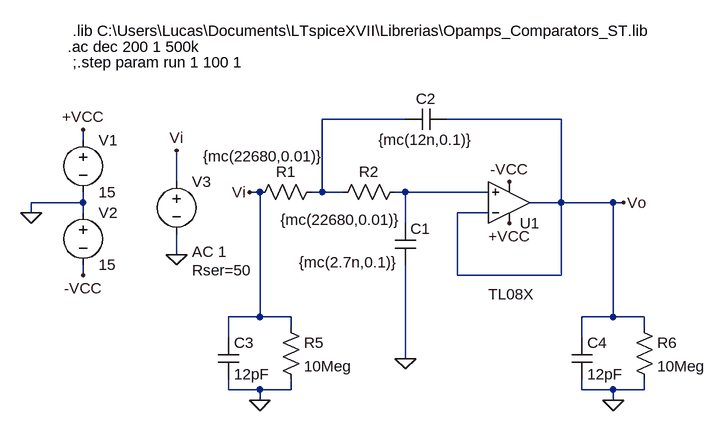
[diagram p0: schematic TerceraEtapa.asc]
TerceraEtapa.asc, the LTspice schematic file:
Version 4
SHEET 1 880 680
WIRE 384 112 256 112
WIRE 624 112 448 112
WIRE -112 144 -112 128
WIRE 32 208 32 160
WIRE 160 224 144 224
WIRE 256 224 256 112
WIRE 256 224 240 224
WIRE 288 224 256 224
WIRE 384 224 368 224
WIRE 512 224 384 224
WIRE -112 240 -112 224
WIRE -112 240 -192 240
WIRE 624 240 624 112
WIRE 624 240 576 240
WIRE 704 240 624 240
WIRE 720 240 704 240
WIRE -192 256 -192 240
WIRE -112 256 -112 240
WIRE 512 256 464 256
WIRE 384 272 384 224
WIRE 32 320 32 288
WIRE -112 352 -112 336
WIRE 464 352 464 256
WIRE 624 352 624 240
WIRE 624 352 464 352
WIRE 160 416 160 224
WIRE 160 416 112 416
WIRE 208 416 160 416
WIRE 704 416 704 240
WIRE 704 416 656 416
WIRE 752 416 704 416
WIRE 208 432 208 416
WIRE 752 432 752 416
WIRE 112 448 112 416
WIRE 656 448 656 416
WIRE 384 480 384 336
WIRE 112 528 112 512
WIRE 160 528 112 528
WIRE 208 528 208 512
WIRE 208 528 160 528
WIRE 656 528 656 512
WIRE 704 528 656 528
WIRE 752 528 752 512
WIRE 752 528 704 528
WIRE 160 544 160 528
WIRE 704 544 704 528
FLAG -192 256 0
FLAG -112 128 +VCC
FLAG -112 352 -VCC
FLAG 32 320 0
FLAG 32 160 Vi
FLAG 544 272 +VCC
FLAG 544 208 -VCC
FLAG 384 480 0
FLAG 720 240 Vo
FLAG 144 224 Vi
FLAG 160 544 0
FLAG 704 544 0
SYMBOL Opamps\\opamp2 544 304 M180
WINDOW 3 -32 -77 Left 2
SYMATTR Value TL08X
SYMATTR InstName U1
SYMBOL voltage -112 128 R0
WINDOW 123 0 0 Left 0
WINDOW 39 0 0 Left 0
SYMATTR InstName V1
SYMATTR Value 15
SYMBOL voltage -112 240 R0
WINDOW 123 0 0 Left 0
WINDOW 39 0 0 Left 0
SYMATTR InstName V2
SYMATTR Value 15
SYMBOL voltage 32 192 R0
WINDOW 123 24 124 Left 2
WINDOW 39 24 152 Left 2
SYMATTR Value2 AC 1
SYMATTR SpiceLine Rser=50
SYMATTR InstName V3
SYMATTR Value ""
SYMBOL res 256 208 R90
WINDOW 0 0 56 VBottom 2
WINDOW 3 -55 90 VTop 2
SYMATTR InstName R1
SYMATTR Value {mc(22680,0.01)}
SYMBOL res 384 208 R90
WINDOW 0 0 56 VBottom 2
WINDOW 3 43 99 VTop 2
SYMATTR InstName R2
SYMATTR Value {mc(22680,0.01)}
SYMBOL cap 368 272 R0
WINDOW 3 -148 60 Left 2
SYMATTR Value {mc(2.7n,0.1)}
SYMATTR InstName C1
SYMBOL cap 448 96 R90
WINDOW 0 0 32 VBottom 2
WINDOW 3 32 32 VTop 2
SYMATTR InstName C2
SYMATTR Value {mc(12n,0.1)}
SYMBOL cap 96 448 R0
SYMATTR InstName C3
SYMATTR Value 12pF
SYMBOL res 192 416 R0
SYMATTR InstName R5
SYMATTR Value 10Meg
SYMBOL cap 640 448 R0
SYMATTR InstName C4
SYMATTR Value 12pF
SYMBOL res 736 416 R0
SYMATTR InstName R6
SYMATTR Value 10Meg
TEXT -128 -24 Left 2 !.lib C:\\Users\\Lucas\\Documents\\LTspiceXVII\\Librerias\\Opamps_Comparators_ST.lib
TEXT -136 0 Left 2 !.ac dec 200 1 500k
TEXT -128 24 Left 2 !;.step param run 1 100 1

The netlist it stands for:
* TerceraEtapa.asc
XU1 N002 Vo +VCC -VCC Vo TL08X  ; pins In+ In- V+ V- OUT
V1 +VCC 0 15
V2 0 -VCC 15
V3 Vi 0 AC 1 Rser=50
R1 N001 Vi {mc(22680,0.01)}
R2 N002 N001 {mc(22680,0.01)}
C1 N002 0 {mc(2.7n,0.1)}
C2 Vo N001 {mc(12n,0.1)}
C3 Vi 0 12pF
R5 Vi 0 10Meg
C4 Vo 0 12pF
R6 Vo 0 10Meg
.lib C:\Users\Lucas\Documents\LTspiceXVII\Librerias\Opamps_Comparators_ST.lib
.ac dec 200 1 500k
;.step param run 1 100 1
.backanno
.end